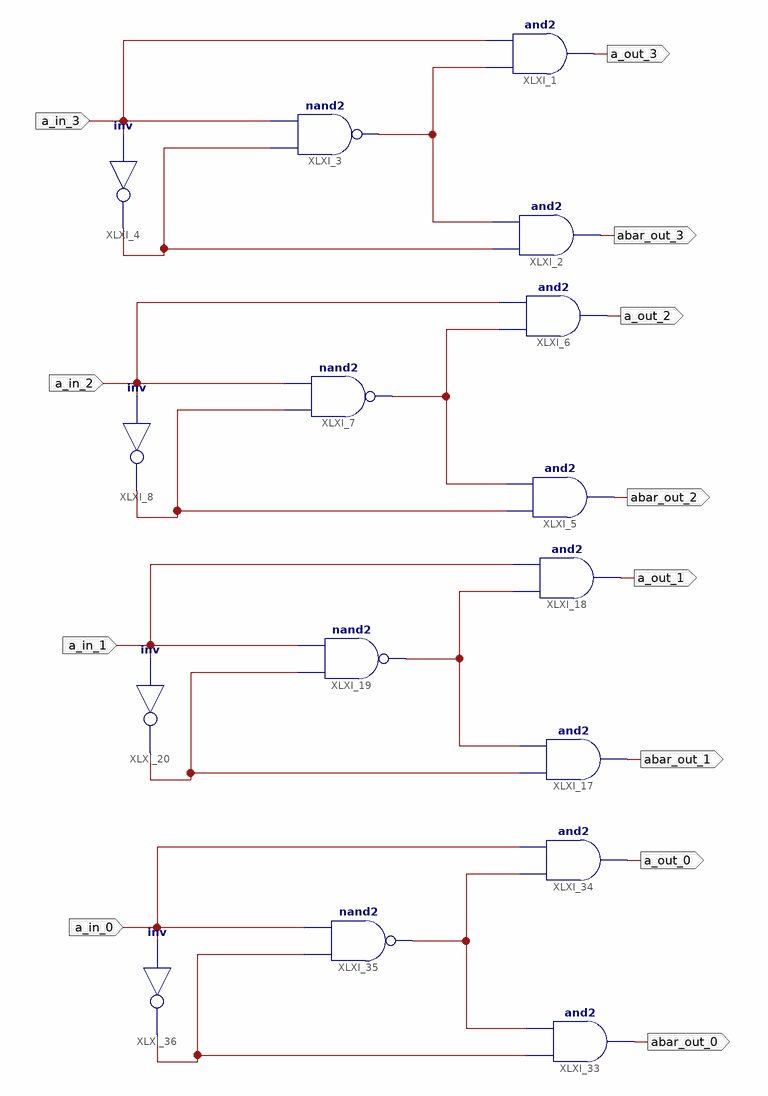
[diagram p0: schematic sheet 1]
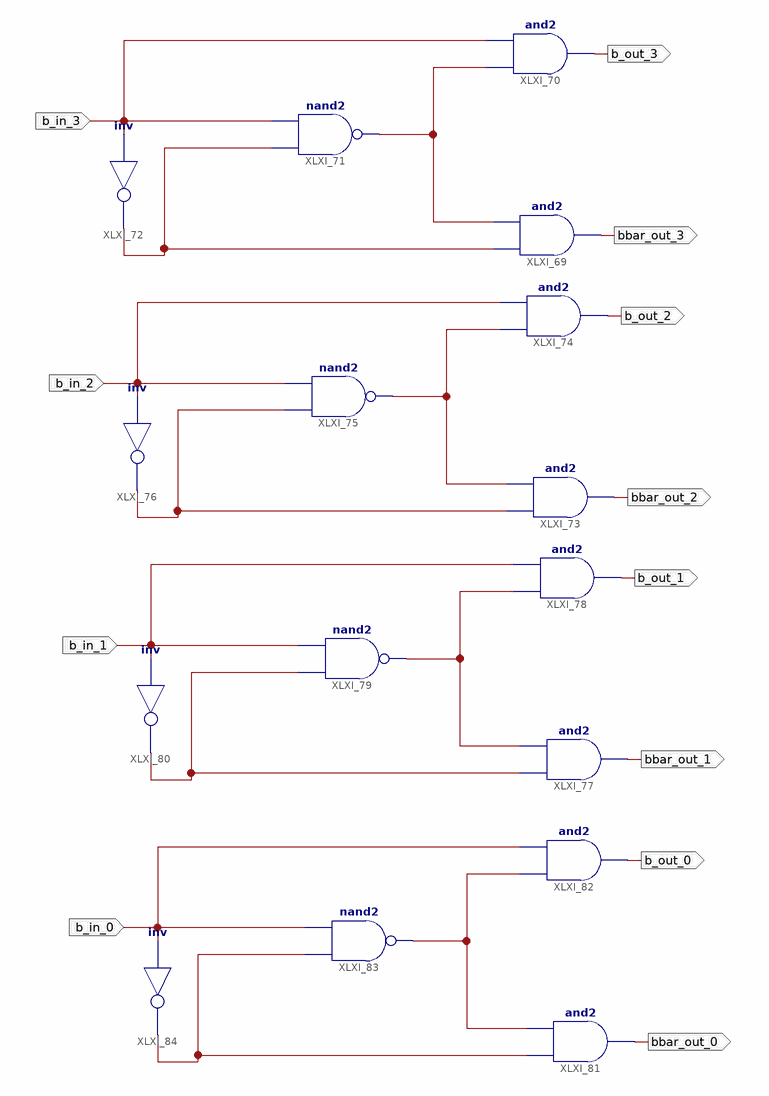
[diagram p1: schematic sheet 2]
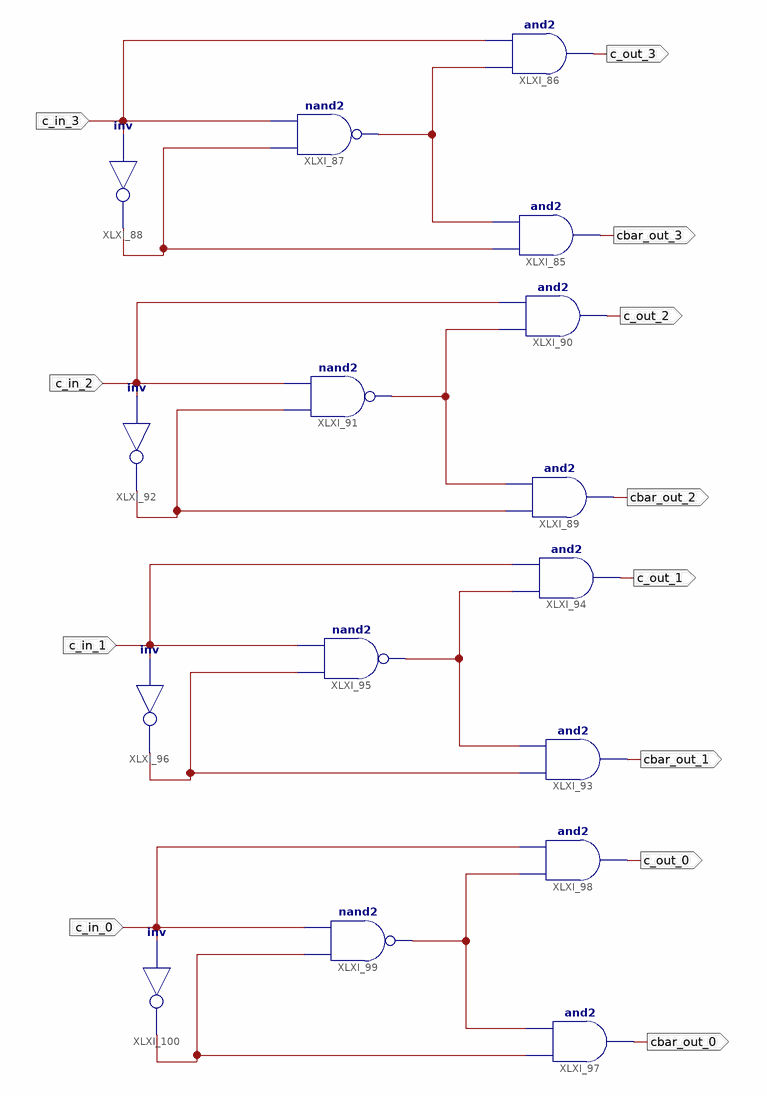
[diagram p2: schematic sheet 3]
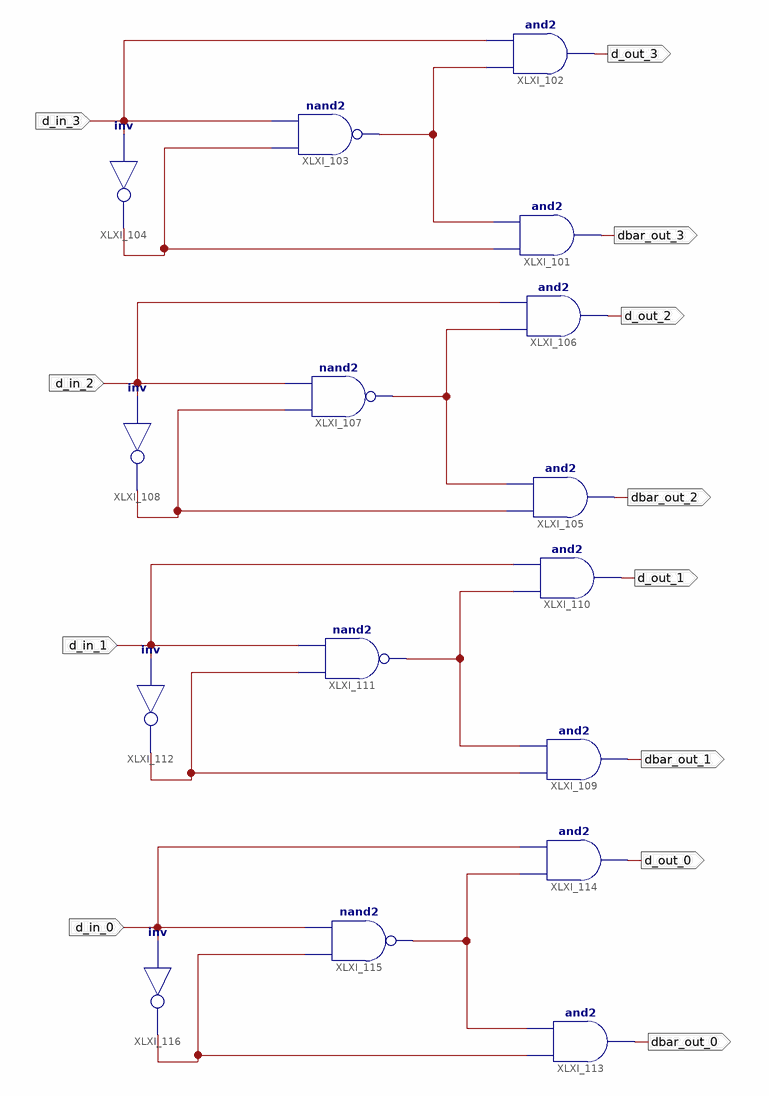
[diagram p3: schematic sheet 4]
// Xilinx ISE schematic inv.sch (spartan6) as structural Verilog: 64 symbols, 48 ports
module inv (
  input  a_in_3,
  input  a_in_2,
  input  a_in_1,
  input  a_in_0,
  input  b_in_3,
  input  b_in_2,
  input  b_in_1,
  input  b_in_0,
  input  c_in_3,
  input  c_in_2,
  input  c_in_1,
  input  c_in_0,
  input  d_in_3,
  input  d_in_2,
  input  d_in_1,
  input  d_in_0,
  output a_out_3,
  output abar_out_3,
  output a_out_2,
  output abar_out_2,
  output a_out_1,
  output abar_out_1,
  output a_out_0,
  output abar_out_0,
  output b_out_3,
  output bbar_out_3,
  output b_out_2,
  output bbar_out_2,
  output b_out_1,
  output bbar_out_1,
  output b_out_0,
  output bbar_out_0,
  output c_out_3,
  output cbar_out_3,
  output c_out_2,
  output cbar_out_2,
  output c_out_1,
  output cbar_out_1,
  output c_out_0,
  output cbar_out_0,
  output d_out_3,
  output dbar_out_3,
  output d_out_2,
  output dbar_out_2,
  output d_out_1,
  output dbar_out_1,
  output d_out_0,
  output dbar_out_0
);

  wire XLXN_6, XLXN_7, XLXN_13, XLXN_14, XLXN_34, XLXN_35, XLXN_62, XLXN_63, XLXN_125, XLXN_126, XLXN_132,
       XLXN_133, XLXN_139, XLXN_140, XLXN_146, XLXN_147, XLXN_153, XLXN_154, XLXN_160, XLXN_161, XLXN_167,
       XLXN_168, XLXN_174, XLXN_175, XLXN_181, XLXN_182, XLXN_188, XLXN_189, XLXN_195, XLXN_196, XLXN_202,
       XLXN_203;

  and XLXI_2 (abar_out_3, XLXN_6, XLXN_7);
  and XLXI_1 (a_out_3, XLXN_7, a_in_3);
  nand XLXI_3 (XLXN_7, XLXN_6, a_in_3);
  not XLXI_4 (XLXN_6, a_in_3);
  and XLXI_5 (abar_out_2, XLXN_13, XLXN_14);
  and XLXI_6 (a_out_2, XLXN_14, a_in_2);
  nand XLXI_7 (XLXN_14, XLXN_13, a_in_2);
  not XLXI_8 (XLXN_13, a_in_2);
  and XLXI_17 (abar_out_1, XLXN_34, XLXN_35);
  and XLXI_18 (a_out_1, XLXN_35, a_in_1);
  nand XLXI_19 (XLXN_35, XLXN_34, a_in_1);
  not XLXI_20 (XLXN_34, a_in_1);
  and XLXI_33 (abar_out_0, XLXN_62, XLXN_63);
  and XLXI_34 (a_out_0, XLXN_63, a_in_0);
  nand XLXI_35 (XLXN_63, XLXN_62, a_in_0);
  not XLXI_36 (XLXN_62, a_in_0);
  and XLXI_69 (bbar_out_3, XLXN_125, XLXN_126);
  and XLXI_70 (b_out_3, XLXN_126, b_in_3);
  nand XLXI_71 (XLXN_126, XLXN_125, b_in_3);
  not XLXI_72 (XLXN_125, b_in_3);
  and XLXI_73 (bbar_out_2, XLXN_132, XLXN_133);
  and XLXI_74 (b_out_2, XLXN_133, b_in_2);
  nand XLXI_75 (XLXN_133, XLXN_132, b_in_2);
  not XLXI_76 (XLXN_132, b_in_2);
  and XLXI_77 (bbar_out_1, XLXN_139, XLXN_140);
  and XLXI_78 (b_out_1, XLXN_140, b_in_1);
  nand XLXI_79 (XLXN_140, XLXN_139, b_in_1);
  not XLXI_80 (XLXN_139, b_in_1);
  and XLXI_81 (bbar_out_0, XLXN_146, XLXN_147);
  and XLXI_82 (b_out_0, XLXN_147, b_in_0);
  nand XLXI_83 (XLXN_147, XLXN_146, b_in_0);
  not XLXI_84 (XLXN_146, b_in_0);
  and XLXI_85 (cbar_out_3, XLXN_153, XLXN_154);
  and XLXI_86 (c_out_3, XLXN_154, c_in_3);
  nand XLXI_87 (XLXN_154, XLXN_153, c_in_3);
  not XLXI_88 (XLXN_153, c_in_3);
  and XLXI_89 (cbar_out_2, XLXN_160, XLXN_161);
  and XLXI_90 (c_out_2, XLXN_161, c_in_2);
  nand XLXI_91 (XLXN_161, XLXN_160, c_in_2);
  not XLXI_92 (XLXN_160, c_in_2);
  and XLXI_93 (cbar_out_1, XLXN_167, XLXN_168);
  and XLXI_94 (c_out_1, XLXN_168, c_in_1);
  nand XLXI_95 (XLXN_168, XLXN_167, c_in_1);
  not XLXI_96 (XLXN_167, c_in_1);
  and XLXI_97 (cbar_out_0, XLXN_174, XLXN_175);
  and XLXI_98 (c_out_0, XLXN_175, c_in_0);
  nand XLXI_99 (XLXN_175, XLXN_174, c_in_0);
  not XLXI_100 (XLXN_174, c_in_0);
  and XLXI_101 (dbar_out_3, XLXN_181, XLXN_182);
  and XLXI_102 (d_out_3, XLXN_182, d_in_3);
  nand XLXI_103 (XLXN_182, XLXN_181, d_in_3);
  not XLXI_104 (XLXN_181, d_in_3);
  and XLXI_105 (dbar_out_2, XLXN_188, XLXN_189);
  and XLXI_106 (d_out_2, XLXN_189, d_in_2);
  nand XLXI_107 (XLXN_189, XLXN_188, d_in_2);
  not XLXI_108 (XLXN_188, d_in_2);
  and XLXI_109 (dbar_out_1, XLXN_195, XLXN_196);
  and XLXI_110 (d_out_1, XLXN_196, d_in_1);
  nand XLXI_111 (XLXN_196, XLXN_195, d_in_1);
  not XLXI_112 (XLXN_195, d_in_1);
  and XLXI_113 (dbar_out_0, XLXN_202, XLXN_203);
  and XLXI_114 (d_out_0, XLXN_203, d_in_0);
  nand XLXI_115 (XLXN_203, XLXN_202, d_in_0);
  not XLXI_116 (XLXN_202, d_in_0);
endmodule
